# EAGLE schematic sources (EAGLE 9.2.0)
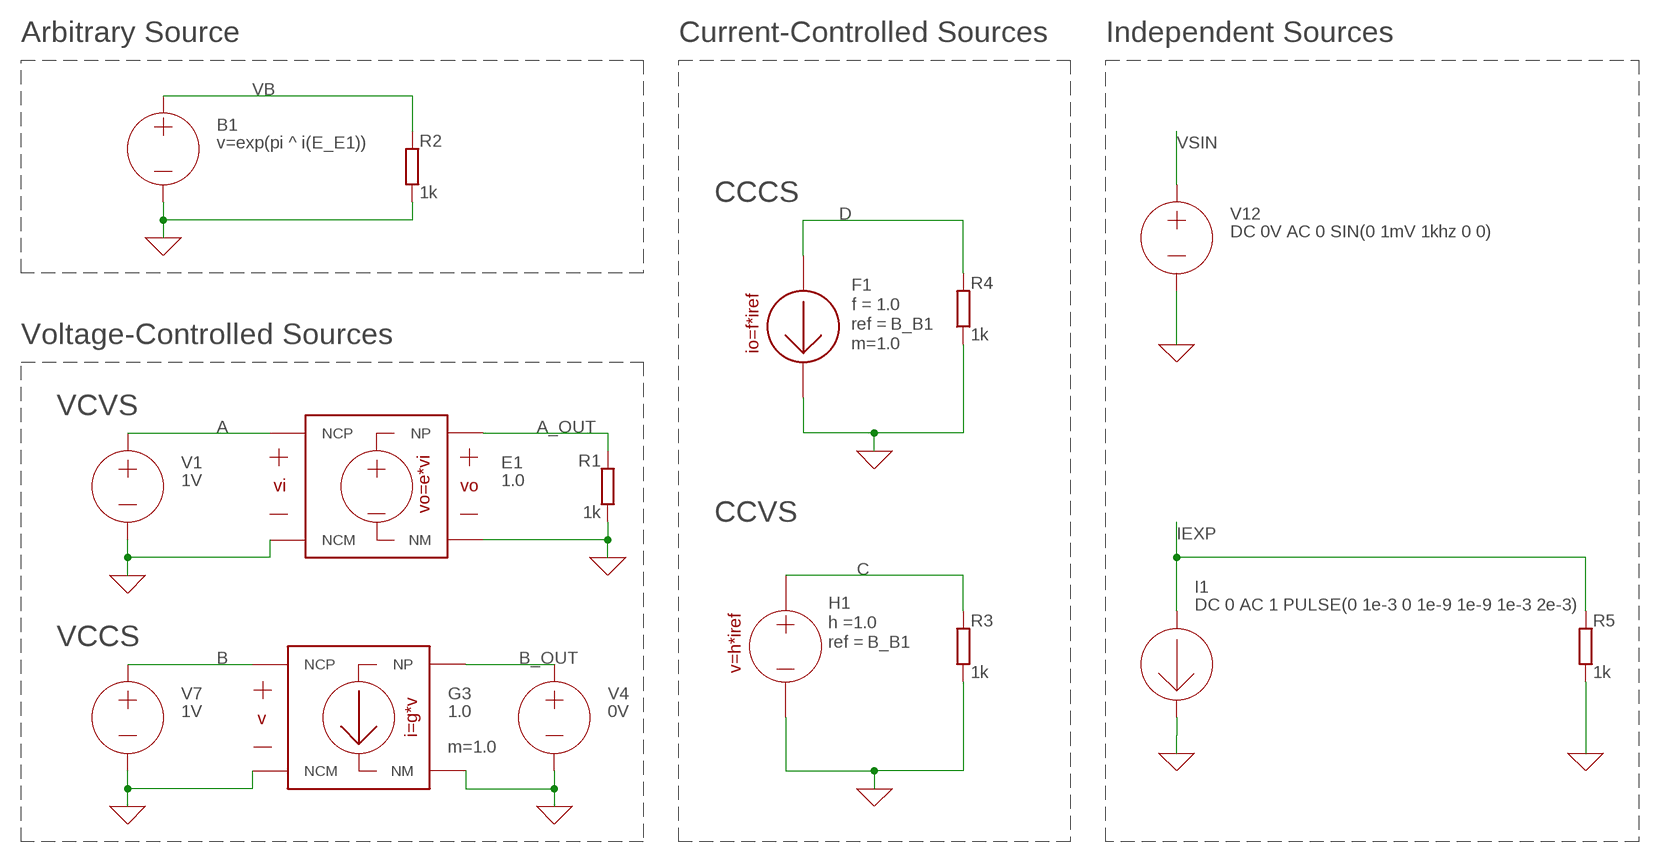
[diagram p0: schematic, sheet 1]

## Parts
B1  v=exp(pi ^ i(E_E1))  NONLIN_ASRC  (no package)
E1  1.0  VCVS  (no package)
F1  1.0  CCCS  (no package)
G3  1.0  VCCS  (no package)
H1  1.0  CCVS  (no package)
I1  DC 0 AC 1 PULSE(0 1e-3 0 1e-9 1e-9 1e-3 2e-3)  CURRENT  (no package)
R1  1k  R  (no package)
R2  1k  R  (no package)
R3  1k  R  (no package)
R4  1k  R  (no package)
R5  1k  R  (no package)
V1  1V  VOLTAGE  (no package)
V4  0V  VOLTAGE  (no package)
V7  1V  VOLTAGE  (no package)
V12  DC 0V AC 0 SIN(0 1mV 1khz 0 0)  VOLTAGE  (no package)

## Nets
0: B1.- E1.NCM E1.NM F1.NM G3.NCM G3.NM H1.NM R1.1 R2.1 R3.1 R4.1 R5.1 V1.- V4.- V7.- V12.- ; supply symbol labelled GND
A: E1.NCP V1.+
A_OUT: E1.NP R1.2
B: G3.NCP V7.+
B_OUT: G3.NP V4.+
C: H1.NP R3.2
D: F1.NP R4.2
IEXP: I1.+ R5.2
N$1: I1.- ; supply symbol labelled GND
VB: B1.+ R2.2
VSIN: V12.+

## Notes on the sheet
- Arbitrary Source | Current-Controlled Sources | Independent Sources
- CCCS
- Voltage-Controlled Sources
- VCVS
- CCVS
- VCCS

## Library data of the parts
B1 = ngspice-simulation:NONLIN_ASRC: Nonlinear dependent source (ASRC) BXXXXXXX n+ n− < i = e x p r > <v= e x p r > < t c 1 = v al u e > < t c 2 = v al u e ><temp= v al u e > <dtemp= v al u e >
E1 = ngspice-simulation:VCVS: Linear Voltage-Controlled Voltage Sources (VCVS) EXXXXXXX N+ N- NC+ NC- VALUE
F1 = ngspice-simulation:CCCS: Linear Current-Controlled Current Sources (CCCS) FXXXXXXX N+ N- VNAME VALUE; SPICEEXTRA: m=1.0; VNAME: B_B1
G3 = ngspice-simulation:VCCS: Linear Voltage-Controlled Current Sources (VCCS) GXXXXXXX N+ N− NC+ NC− VALUE <m= v al >; SPICEEXTRA: m=1.0
H1 = ngspice-simulation:CCVS: Linear Current-Controlled Voltage Sources (CCVS) HXXXXXXX N+ N- VNAME VALUE; VNAME: B_B1
I1 = ngspice-simulation:CURRENT: Independent Current Source; VALUE: 0A
R1-R5 = ngspice-simulation:R: RESISTOR
V1 V7 V12 = ngspice-simulation:VOLTAGE: Independent Voltage Source, either DC, AC, PULSE, SINE, PWL, EXP, or SFFM; VALUE: 0V
V4 = ngspice-simulation:VOLTAGE: Independent Voltage Source, either DC, AC, PULSE, SINE, PWL, EXP, or SFFM